# Altium schematic sheet Voltage_Measurement.SchDoc
size A4; CompanyName: Technische Hochschule Nürnberg Georg Simon Ohm; Organization: UltraZohm; Address1: Kesslerplatz 12; Address2: 90489 Nürnberg; Address3: GERMANY; Website: www.ultrazohm.com
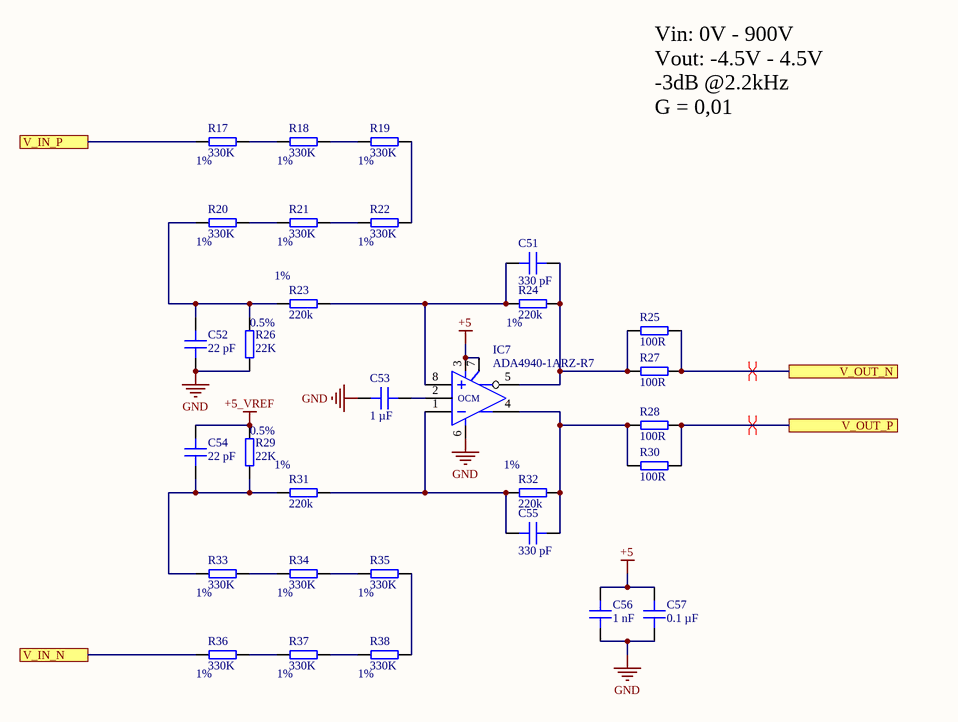
[diagram p0: Voltage_Measurement.SchDoc]

## Parts
C51  330 pF  [C_0603]
C52  22 pF  [C_0603]
C53  1 µF  [C_0603]
C54  22 pF  [C_0603]
C55  330 pF  [C_0603]
C56  1 nF  [C_0603]
C57  0.1 µF  [C_0603]
IC7  ADA4940-1ARZ-R7  [SOIC-8-N]
R17  330K  Tolerance: 1%  [RES 1206_3216]
R18  330K  Tolerance: 1%  [RES 1206_3216]
R19  330K  Tolerance: 1%  [RES 1206_3216]
R20  330K  Tolerance: 1%  [RES 1206_3216]
R21  330K  Tolerance: 1%  [RES 1206_3216]
R22  330K  Tolerance: 1%  [RES 1206_3216]
R23  220k  Tolerance: 1%  [RES 0603_1608]
R24  220k  Tolerance: 1%  [RES 0603_1608]
R25  100R  [RES 0603_1608]
R26  22K  Tolerance: 0.5%  [RES 0603_1608]
R27  100R  [RES 0603_1608]
R28  100R  [RES 0603_1608]
R29  22K  Tolerance: 0.5%  [RES 0603_1608]
R30  100R  [RES 0603_1608]
R31  220k  Tolerance: 1%  [RES 0603_1608]
R32  220k  Tolerance: 1%  [RES 0603_1608]
R33  330K  Tolerance: 1%  [RES 1206_3216]
R34  330K  Tolerance: 1%  [RES 1206_3216]
R35  330K  Tolerance: 1%  [RES 1206_3216]
R36  330K  Tolerance: 1%  [RES 1206_3216]
R37  330K  Tolerance: 1%  [RES 1206_3216]
R38  330K  Tolerance: 1%  [RES 1206_3216]

## Ports
V_IN_N, V_IN_P, V_OUT_N, V_OUT_P

## Nets
+5: C56.2 C57.2 IC7.3(V+) IC7.7(EN)
+5_VREF: C54.2 R29.2
GND: C52.1 C53.1 C56.1 C57.1 IC7.6(V-) R26.1
V_IN_N: R36.1 ; port V_IN_N
V_IN_P: R17.1 ; port V_IN_P
V_OUT_N: R25.2 R27.2 ; port V_OUT_N
V_OUT_P: R28.2 R30.2 ; port V_OUT_P
NetC51_1: C51.1 IC7.8(+) R23.2 R24.1
NetC51_2: C51.2 IC7.5(Out) R24.2 R25.1 R27.1
NetC52_2: C52.2 R20.1 R23.1 R26.2
NetC53_2: C53.2 IC7.2(OCM)
NetC54_1: C54.1 R29.1 R31.1 R33.1
NetC55_1: C55.1 IC7.1(-) R31.2 R32.1
NetC55_2: C55.2 IC7.4(Out) R28.1 R30.1 R32.2
NetR17_2: R17.2 R18.1
NetR18_2: R18.2 R19.1
NetR19_2: R19.2 R22.2
NetR20_2: R20.2 R21.1
NetR21_2: R21.2 R22.1
NetR33_2: R33.2 R34.1
NetR34_2: R34.2 R35.1
NetR35_2: R35.2 R38.2
NetR36_2: R36.2 R37.1
NetR37_2: R37.2 R38.1

## Layout directives
differential pair: V_OUT_N, V_OUT_P

## Notes on the sheet
- Vin: 0V - 900V
  Vout: -4.5V - 4.5V
  -3dB @2.2kHz
  G = 0,01
- Title
- Revision:
- Design Engineer:
- Date:
- Project:
- Sheet
- of

## Library data of the parts
C51 C55 = C0603X331J5RAC3112: Capacitor 0603, 50 VDC, 330 pF, X7R; Manufacturer: KEMET; Tolerance: 5 %; Voltage Rating: 50 VDC; Created from: MGremer; Manufacturer Part Number: C0603X331J5RAC3112; PartID: 8; Created On: 20.12.2020 13:54:13; ComponentLink1Description: Datasheet; ComponentLink1URL: https://www.mouser.de/datasheet/2/212/1/KEM_C1013_X7R_FT_CAP_SMD-1103280.pdf; Component Type: Capacitor 0603; Device Package: 0603; Last Updated: 15.02.2023 17:14:22; Mounting Type: SMD; Operating Temperature: -55 - 125°C; Series: SMD Comm X7R Flex; Supplier 1: Mouser; Supplier Part Number 1: 80-C0603X331J5R3112; Type: Capacitor; Value: 330 pF; Live Cycle Status: 1; Stock number: Labor SMD Container; Supplier 2: LCSC; Supplier Part Number 2: C107087
C52 C54 = C0603C220J5RACTU: Capacitor 0603, 50 VDC, 22 pF, X7R; Manufacturer: KEMET; Tolerance: 5 %; Voltage Rating: 50 VDC; Created from: MGremer; Manufacturer Part Number: C0603C220J5RACTU; PartID: 78; Created On: 20.12.2020 13:54:13; ComponentLink1Description: Datasheet; ComponentLink1URL: https://www.mouser.de/datasheet/2/212/KEM_C1002_X7R_SMD-1102033.pdf; Component Type: Capacitor 0603; Device Package: 0603; Last Updated: 20.01.2021 13:57:36; Mounting Type: SMD; Operating Temperature: -55 - 125°C; Series: SMD Comm X7R; Supplier 1: Mouser; Supplier Part Number 1: 80-C0603C220J5R; Type: Capacitor; Value: 22 pF; Live Cycle Status: 1; Stock number: not stored
C53 = UMK107AB7105KA-T: 50V 1uF X7R ±10% 0603 Multilayer Ceramic Capacitors MLCC - SMD/SMT ROHS; Manufacturer: Taiyo Yuden; Voltage Rating: 50 VDC; Created from: NDiringer; Manufacturer Part Number: UMK107AB7105KA-T; PartID: 98; Created On: 09.08.2022 09:35:02; ComponentLink1Description: Datasheet; ComponentLink1URL: https://www.mouser.de/datasheet/2/396/mlcc02_e-1307760.pdf; Component Type: Capacitor 0603; Device Package: 0603; Last Updated: 21.09.2022 16:11:37; Mounting Type: SMD; Operating Temperature: -55 - 125°C; Series: X7R; Supplier 1: LCSC; Supplier Part Number 1: C105174; Supplier 2: Mouser; Supplier Part Number 2: 963-UMK107AB7105MA-T; Type: Capacitor; Tolerance: 10 %; Value: 1 µF; Live Cycle Status: 1; LCSC Part Number: C105174; Stock number: not stored
C56 = CC0603JRNPO9BN102: Capacitor 0603, 50 VDC, 1 nF, NP0; Manufacturer: YAGEO; Tolerance: 5 %; Voltage Rating: 50 VDC; Created from: AGeiger; Manufacturer Part Number: CC0603JRNPO9BN102; PartID: 104; Created On: 30.08.2022 11:46:28; ComponentLink1Description: Datasheet; ComponentLink1URL: https://datasheet.lcsc.com/lcsc/1811021411_YAGEO-CC0603JRNPO9BN102_C106246.pdf; Component Type: Capacitor 0603; Device Package: 0603; Last Updated: 30.08.2022 11:46:28; Mounting Type: SMD; Operating Temperature: -55 - 125°C; Series: NP0; Supplier 1: LCSC; Supplier Part Number 1: C106246; Type: Capacitor; Value: 1 nF; Live Cycle Status: 1; LCSC Part Number: C106246
C57 = C0603X104K5RAC7411: Capacitor 0603, 50 VDC, 0.1 µF, X7R; Manufacturer: KEMET; Tolerance: 10 %; Voltage Rating: 50 VDC; Created from: MGremer; Manufacturer Part Number: C0603X104K5RAC7411; PartID: 3; Created On: 20.12.2020 13:54:13; ComponentLink1Description: Datasheet; ComponentLink1URL: https://www.mouser.de/datasheet/2/212/1/KEM_C1013_X7R_FT_CAP_SMD-1103280.pdf; Component Type: Capacitor 0603; Device Package: 0603; Last Updated: 04.03.2021 09:24:28; Mounting Type: SMD; Operating Temperature: -55 - 125°C; Series: SMD Comm X7R Flex; Supplier 1: Mouser; Supplier Part Number 1: 80-C0603X104K5R7411; Supplier 2: LCSC; Supplier Part Number 2: C14663; Type: Capacitor; Value: 0.1 µF; Live Cycle Status: 1; LCSC Part Number: C14663; Stock number: Labor SMD Container
IC7 = ADA4940-1ARZ-R7: Differential ADC Driver; Manufacturer: Analog Devices; Class I: Analog; Class II: Fully Differential ADC Drivers (-40-125°C); Best.-Nr.: Farnell 209-6178; Channels: 1; Created from: MGremer; Datasheet: DSO11449, Ver. Aug 2000; Last edited: 04.01.2007 10:14; Package Reference: SOIC-N-8; Manufacturer Part Number: ADA4940-1ARZ-R7; PartID: 3; Created On: 15.01.2021 12:16:53; ComponentLink1Description: Datasheet; ComponentLink1URL: https://www.mouser.de/datasheet/2/609/ADA4940-1_4940-2-878284.pdf; Component Type: ADC; Device Package: SOIC-8; Last Updated: 22.11.2021 15:19:18; Mounting Type: SMD; Operating Temperature: -40 - 105 °C; Supplier 1: Mouser; Supplier Part Number 1: 584-ADA4940-1ARZ-R7; Type: ADC; Resolution: -; Value: differential ADC driver; Live Cycle Status: 1; Stock number: not stored
R17-R22 R33-R38 = RT1206FRE07330KL: SMD resistor E24 series 330K OHM 1% 50PPM 1/4W; Manufacturer: YAGEO; Created from: StarostV; Manufacturer Part Number: RT1206FRE07330KL; PartID: 254; Created On: 02.02.2023 10:18:00; ComponentLink1Description: Datasheet; ComponentLink1URL: https://www.mouser.de/datasheet/2/447/PYu_RT_1_to_0_01_RoHS_L_12-3003070.pdf; Component Type: SMD resistor; Device Package: 1206; Last Updated: 15.02.2023 17:25:43; Mounting Type: SMD; Supplier 1: Mouser; Supplier Part Number 1: 603-RT1206FRE07330KL; Type: Resistor; Value: 330K; Live Cycle Status: 1; Stock number: not stored; LCSC Part Number: C706451
R23 R24 R31 R32 = AC0603FR-07220KL: SMD resistor 1%; Manufacturer: YAGEO; Created from: VStarost; Manufacturer Part Number: AC0603FR-07220KL; PartID: 251; Created On: 28.12.2022 09:11:18; ComponentLink1Description: Datasheet; ComponentLink1URL: https://www.mouser.de/datasheet/2/447/PYu_AC_51_RoHS_L_9-3005297.pdf; Component Type: SMD resistor; Device Package: 0603; Last Updated: 15.02.2023 17:42:19; Mounting Type: SMD; Supplier 1: Mouser; Supplier Part Number 1: 603-AC0603FR-07220KL; Type: Resistor; Value: 220k; Live Cycle Status: 1; Stock number: not stored; LCSC Part Number: C304719
R25 R27 R28 R30 = RK73B1JTTD101J: SMD resistor E24 series; Manufacturer: KOA Speer; Tolerance: 5%; Created from: MGremer; Manufacturer Part Number: RK73B1JTTD101J; PartID: 50; Created On: 14.12.2020 16:17:14; ComponentLink1Description: Datasheet; ComponentLink1URL: https://www.mouser.de/datasheet/2/219/RK73B-1825463.pdf; Component Type: SMD resistor; Device Package: 0603; Last Updated: 29.11.2022 14:30:07; Mounting Type: SMD; Supplier 1: Mouser; Supplier Part Number 1: 660-RK73B1JTTD101J; Supplier 2: LCSC; Supplier Part Number 2: C22775; Type: Resistor; Value: 100R; Live Cycle Status: 1; Stock number: Labor SMD Container; LCSC Part Number: C22775
R26 R29 = RT0603DRE0722KL: SMD resistor E24 series 22K 0.5% 1/10W 75 Volts 50ppm; Manufacturer: YAGEO; Created from: VStarost; Manufacturer Part Number: RT0603DRE0722KL; PartID: 255; Created On: 02.02.2023 11:53:54; ComponentLink1Description: Datasheet; ComponentLink1URL: https://www.mouser.de/datasheet/2/447/PYu_RT_1_to_0_01_RoHS_L_12-3003070.pdf; Component Type: SMD resistor; Device Package: 0603; Last Updated: 15.02.2023 18:00:16; Mounting Type: SMD; Supplier 1: Mouser; Supplier Part Number 1: 603-RT0603DRE0722KL; Type: Resistor; Value: 22K; Live Cycle Status: 1; Stock number: not stored; LCSC Part Number: C705960